# Altium project NFCard.PrjPcb
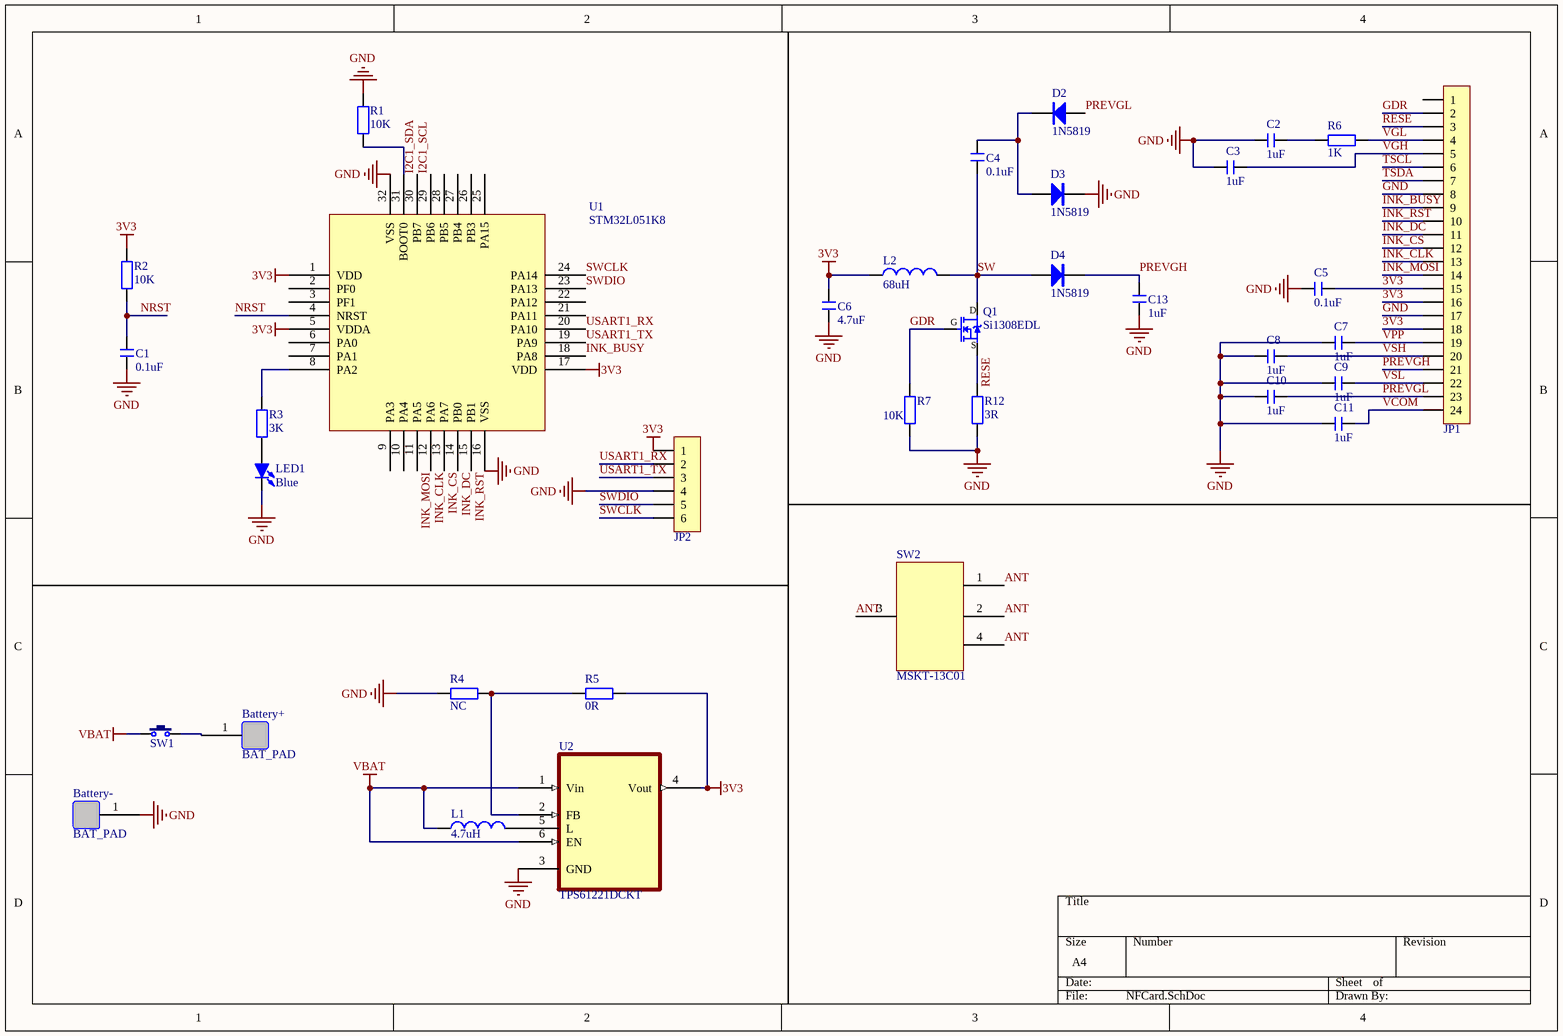
[diagram p0: NFCard.SchDoc]
1 sheet, 35 parts. Net scope: global (net labels, ports and power ports of the same name join across sheets).
Board file: NFCard.PcbDoc

## Sheet NFCard.SchDoc
size A4

### Parts
Battery+  BAT_PAD  [BAT_PAD]
Battery-  BAT_PAD  [BAT_PAD]
C1  0.1uF  [C 0603_L]
C2  1uF  [C 0603_L]
C3  1uF  [C 0603_L]
C4  0.1uF  [C 0603_L]
C5  0.1uF  [C 0603_L]
C6  4.7uF  [C 0603_L]
C7  1uF  [C 0603_L]
C8  1uF  [C 0603_L]
C9  1uF  [C 0603_L]
C10  1uF  [C 0603_L]
C11  1uF  [C 0603_L]
C13  1uF  [C 0603_L]
D2  1N5819  [SOD-323]
D3  1N5819  [SOD-323]
D4  1N5819  [SOD-323]
JP1  FPC1.0-24P  [FPC0.5 CB-24P]  (value not drawn)
JP2  HDR-1X6  [HDR1.27-M-6P-S]  (value not drawn)
L1  4.7uH  [L 0805_L]
L2  68uH  [FB 2520_L]
LED1  Blue  [LED 0603B]
Q1  Si1308EDL  [SOT23-3L]
R1  10K  [R 0603_L]
R2  10K  [R 0603_L]
R3  3K  [R 0603_L]
R4  NC  [R 0603_L]
R5  0R  [R 0603_L]
R6  1K  [R 0603_L]
R7  10K  [R 0603_L]
R12  3R  [R 0603_L]
SW1  3x6x5  [TSW SMD-3*4*2]  (value not drawn)
SW2  MSKT-13C01  [MSKT-13C01]
U1  STM32L051K8  [TQFP32 7x7_N]
U2  TPS61221DCKT  [SOT23-6L]

### Nets
3V3: C5.2 C6.2 JP1.15 JP1.16 JP1.18 JP2.1 L2.1 R2.2 R5.2 U1.1(VDD) U1.5(VDDA) U1.17(VDD) U2.4(Vout)
GND: Battery-.1 C1.1 C2.1 C3.1 C5.1 C6.1 C7.1 C8.1 C9.1 C10.1 C11.1 C13.1 D3.2(K) JP1.8 JP1.17 JP2.4 LED1.2(K) R1.2 R4.1 R7.1 R12.1 U1.16(VSS) U1.32(VSS) U2.3(GND)
VBAT: L1.1 SW1.1 U2.1(Vin) U2.6(EN)
ANT: SW2.1 SW2.2 SW2.3 SW2.4
GDR: JP1.2 Q1.1(G) R7.2
I2C1_SCL: U1.29(PB6)
I2C1_SDA: U1.30(PB7)
INK_BUSY: JP1.9 U1.18(PA8)
INK_CLK: JP1.13 U1.12(PA6)
INK_CS: JP1.12 U1.13(PA7)
INK_DC: JP1.11 U1.14(PB0)
INK_MOSI: JP1.14 U1.11(PA5)
INK_RST: JP1.10 U1.15(PB1)
NRST: C1.2 R2.1 U1.4(NRST)
PREVGH: C13.2 D4.2(K) JP1.21
PREVGL: C10.2 D2.1(A) JP1.23
RESE: JP1.3 Q1.2(S) R12.2
SW: C4.1 D4.1(A) L2.2 Q1.3(D)
SWCLK: JP2.6 U1.24(PA14)
SWDIO: JP2.5 U1.23(PA13)
TSCL: JP1.6
TSDA: JP1.7
USART1_RX: JP2.2 U1.20(PA10)
USART1_TX: JP2.3 U1.19(PA9)
VCOM: C11.2 JP1.24
VGH: C3.2 JP1.5
VGL: JP1.4 R6.2
VPP: C7.2 JP1.19
VSH: C8.2 JP1.20
VSL: C9.2 JP1.22
NetBattery+_1: Battery+.1 SW1.2
NetC2_2: C2.2 R6.1
NetC4_2: C4.2 D2.2(K) D3.1(A)
NetL1_2: L1.2 U2.5(L)
NetLED1_1: LED1.1(A) R3.1
NetR1_1: R1.1 U1.31(BOOT0)
NetR3_2: R3.2 U1.8(PA2)
NetR4_2: R4.2 R5.1 U2.2(FB)

Not connected (* = marked no-connect by the designer): JP1 1; U1 2(PF0) 3(PF1) 6(PA0) 7(PA1) 9(PA3) 10(PA4) 21(PA11) 22(PA12) 25(PA15) 26(PB3) 27(PB4) 28(PB5)

### Library data of the parts
C1-C11 C13 = C: 无极性贴片电容; 版权归属: 源创客; 材质: X7R; BOM名称: 无极性贴片电容; 学习资源: www.ooocke.com
D2-D4 = 1N5819: 肖特基二极管; 版权归属: 源创客; 属性: 40V/2A; BOM名称: 肖特基二极管; 学习资源: www.ooocke.com
JP1 = FPC-24P: FPC连接器; pin to pad: 1>24 2>23 3>22 4>21 5>20 6>19 7>18 8>17 9>16 10>15 11>14 12>13 13>12 14>11 15>10 16>9 17>8 18>7 19>6 20>5 21>4 22>3 23>2 24>1; 版权归属: 源创客; BOM名称: FPC连接器; 学习资源: www.ooocke.com
JP2 = Header 6: 6P接插件; 版权归属: 源创客; BOM名称: 6P接插件; 学习资源: www.ooocke.com
L1 L2 = L: 小功率贴片电感; 版权归属: 源创客; BOM名称: 小功率贴片电感; 学习资源: www.ooocke.com
LED1 = LED-SMD: 贴片LED; 版权归属: 源创客; BOM名称: 贴片LED; 学习资源: www.ooocke.com
Q1 = AO3400: N沟道 30V/4.2A; BOM名称: 场效应管; 版权归属: 源创客; 学习资源: www.ooocke.com; 描述: N沟道 30V/4.2A
R1-R7 R12 = R: 贴片电阻; 版权归属: 源创客; BOM名称: 贴片电阻; 学习资源: www.ooocke.com
SW1 = TSW 3x6: 3x6轻触开关; 版权归属: 源创客; BOM名称: 3x6轻触开关; 学习资源: www.ooocke.com
SW2 = MSKT-13C01: 七脚拨动开关